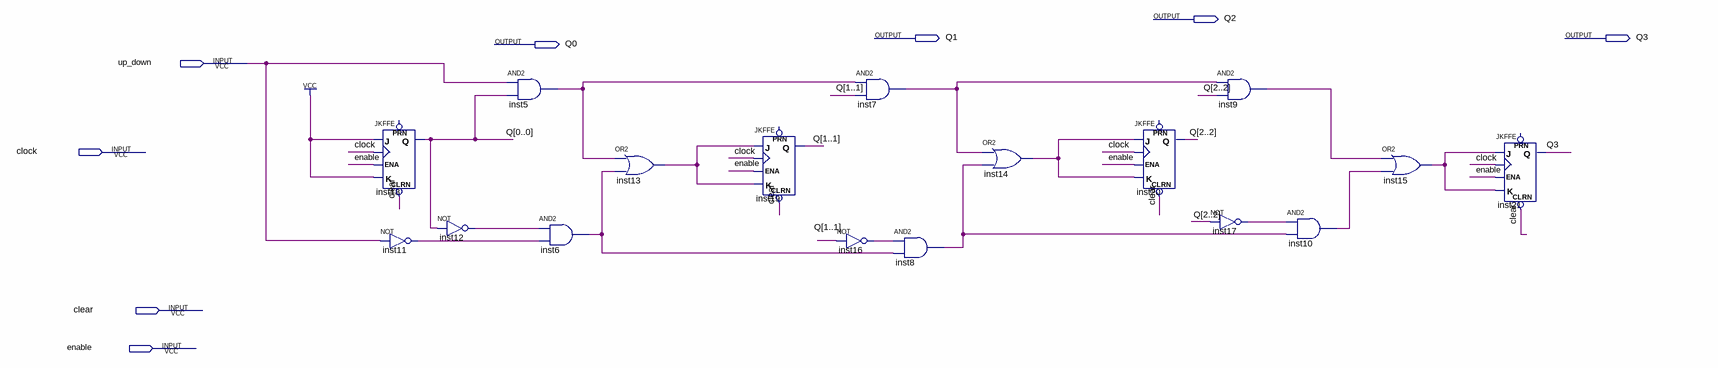
[diagram p0: schematic sheet]
// Quartus schematic up_down_counter.bdf as structural Verilog: 17 symbols, 8 pins
module up_down_counter (
  input  up_down,
  input  clock,
  input  clear,
  input  enable,
  output Q2,
  output Q1,
  output Q3,
  output Q0
);

  wire inst5_out, inst6_out, inst7_out, inst8_out, inst9_out, inst10_out, inst11_out, inst12_out, inst13_out,
       inst14_out, inst15_out, inst16_out, inst17_out;

  JKFFE inst18 (.J(1'b1), .CLK(clock), .CLRN(clear), .K(1'b1), .ENA(enable), .Q(Q0));  // open: PRN
  not inst11 (inst11_out, up_down);
  not inst12 (inst12_out, Q0);
  and inst5 (inst5_out, up_down, Q0);
  and inst6 (inst6_out, inst12_out, inst11_out);
  or inst13 (inst13_out, inst5_out, inst6_out);
  JKFFE inst19 (.J(inst13_out), .CLK(clock), .CLRN(clear), .K(inst13_out), .ENA(enable), .Q(Q1));  // open: PRN
  and inst7 (inst7_out, inst5_out, Q1);
  not inst16 (inst16_out, Q1);
  and inst8 (inst8_out, inst16_out, inst6_out);
  or inst14 (inst14_out, inst7_out, inst8_out);
  JKFFE inst20 (.J(inst14_out), .CLK(clock), .CLRN(clear), .K(inst14_out), .ENA(enable), .Q(Q2));  // open: PRN
  and inst9 (inst9_out, inst7_out, Q2);
  not inst17 (inst17_out, Q2);
  and inst10 (inst10_out, inst17_out, inst8_out);
  or inst15 (inst15_out, inst9_out, inst10_out);
  JKFFE inst21 (.J(inst15_out), .CLK(clock), .CLRN(clear), .K(inst15_out), .ENA(enable), .Q(Q3));  // open: PRN
endmodule
